# EAGLE design Circuit2 (EAGLE 7.7.0)
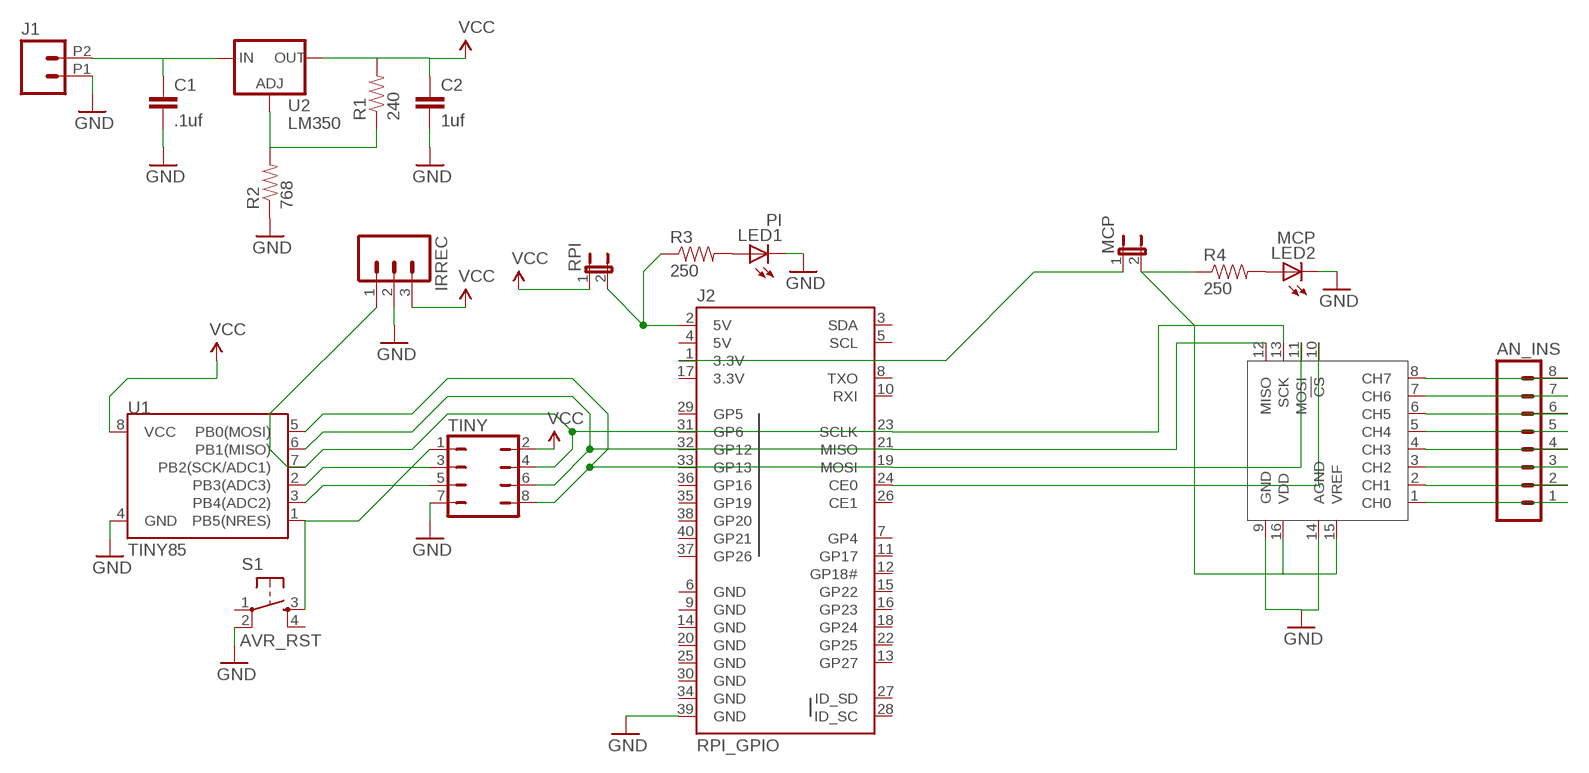
[diagram p0: schematic, sheet 1]

## Parts
ADC  MCP3008SL  [SO16]
AN_INS  M08  [1X08_ROUND]
C1  .1uf  CAP0805  [0805]
C2  1uf  CAP0805  [0805]
IRREC  M03PTH  [1X03]
J1  M022.54MM_SCREWTERM  [1X02_2.54_SCREWTERM]
J2  RPI_GPIO  RASPBERRYPI-40-PIN-GPIO  [2X20-SHROUDED]
LED1  PI  LED1206  [LED-1206]
LED2  MCP  LED1206  [LED-1206]
MCP  JP1E  [JP1]
R1  240  RESISTOR0805-RES  [0805]
R2  768  RESISTOR0805-RES  [0805]
R3  250  RESISTOR1206  [1206]
R4  250  RESISTOR1206  [1206]
RPI  JP1E  [JP1]
S1  AVR_RST  TACTILE-SWITCH-PTH  [TAC-SWITCH-PTH]
TINY  JP4Q  [JP4Q]
U1  TINY85  ATTINY45TINY85-20-DIP  [DIP08]
U2  LM350  V_REG_317SINK  [TO220-ADJ]

## Nets
GND [VCC]: ADC.9(GND) ADC.14(AGND) C1.2 C2.2 IRREC.2 J1.P1 J2.39(GND) LED1.C LED2.C R2.1 S1.2 TINY.7 U1.4(GND)
N$1: ADC.11(MOSI) J2.19(MOSI) TINY.8 U1.5(PB0(MOSI))
N$2: ADC.12(MISO) J2.21(MISO) TINY.6 U1.6(PB1(MISO))
N$3: ADC.13(SCK) IRREC.1 J2.23(SCLK) TINY.4 U1.7(PB2(SCK/ADC1))
N$4 [VCC]: J2.2(5V) R3.1 RPI.2
N$5: TINY.3 U1.2(PB3(ADC3))
N$6: S1.3 TINY.1 U1.1(PB5(NRES))
N$7: TINY.5 U1.3(PB4(ADC2))
N$8: ADC.15(VREF) ADC.16(VDD) MCP.2 R4.1
N$9: R1.1 R2.2 U2.ADJ
N$10: ADC.8(CH7) AN_INS.8
N$11: C1.1 J1.P2 U2.IN
N$12: ADC.10(!CS) J2.24(CE0)
N$13: J2.1(3.3V) MCP.1
N$14: ADC.7(CH6) AN_INS.7
N$15: ADC.6(CH5) AN_INS.6
N$16: ADC.5(CH4) AN_INS.5
N$17: ADC.4(CH3) AN_INS.4
N$18: ADC.3(CH2) AN_INS.3
N$19: ADC.2(CH1) AN_INS.2
N$20: ADC.1(CH0) AN_INS.1
N$21: LED1.A R3.2
N$22: LED2.A R4.2
VCC [VCC]: C2.1 IRREC.3 R1.2 RPI.1 TINY.2 U1.8(VCC) U2.OUT
Unconnected: J2.3(SDA) J2.5(SCL) J2.7(GP4) J2.8(TXO) J2.10(RXI) J2.11(GP17) J2.12(GP18#) J2.13(GP27) J2.15(GP22) J2.16(GP23) J2.18(GP24) J2.22(GP25) J2.26(CE1) J2.27(ID_SD) J2.28(ID_SC) J2.29(GP5) J2.31(GP6) J2.32(GP12) J2.33(GP13) J2.35(GP19) J2.36(GP16) J2.37(GP26) J2.38(GP20) J2.40(GP21) S1.1 S1.4

## Power pins joined to a net without a drawn wire
3.3V: J2.17(3.3V)
5V: J2.4(5V)
GND: J2.6(GND) J2.9(GND) J2.14(GND) J2.20(GND) J2.25(GND) J2.30(GND) J2.34(GND)

## Library data of the parts
ADC = MCP3008:MCP3008
AN_INS = SparkFun-Connectors:M08: Header 8 Standard 8-pin 0.1" header. Use with straight break away headers (SKU : PRT-00116), right angle break away headers (PRT-00553), swiss pins (PRT-00743), machine pins (PRT-00117), and female headers (PRT-00115).; PROD_ID: CONN-08437
C1 C2 = SparkFun-Capacitors:CAP: Capacitor Standard 0603 ceramic capacitor, and 0.1" leaded capacitor.
IRREC = SparkFun-Connectors:M03: Header 3 Standard 3-pin 0.1" header. Use with straight break away headers (SKU : PRT-00116), right angle break away headers (PRT-00553), swiss pins (PRT-00743), machine pins (PRT-00117), and female headers (PRT-00115). Molex polarized connector foot print use with SKU : PRT-08232 with associated crimp pins and housings.
J1 = SparkFun-Connectors:M02: Standard 2-pin 0.1" header. Use with - straight break away headers ( PRT-00116) - right angle break away headers (PRT-00553) - swiss pins (PRT-00743) - machine pins (PRT-00117) - female headers (PRT-00115) Molex polarized connector foot print use with: PRT-08233 with associated crimp pins and housings. 2.54_SCREWTERM for use with PRT-10571. 3.5mm Screw Terminal footprints for PRT-08084 5mm Screw Terminal footprints for use with PRT-08432
J2 = SparkFun-Boards:RASPBERRYPI-40-PIN-GPIO: Second Generation Raspberry Pi GPIO Header 2x20 pin connector, as found on B, B+, A+ models.
LED1 LED2 = LilyPad-Wearables:LED: LEDs Standard schematic elements and footprints for 5mm, 3mm, 1206, and 0603 sized LEDs. 5mm - Spark Fun Electronics SKU : Comp-SBL
MCP RPI = jumper:JP1E: JUMPER
R1-R4 = SparkFun-Passives:RESISTOR: Resistor Basic schematic elements and footprints for 0603, 1206, and PTH resistors.
S1 = GeekAmmo:TACTILE-SWITCH: Tactile Switch 4 Pins, SPST NO
TINY = jumper:JP4Q: JUMPER
U1 = SparkFun-DigitalIC:ATTINY45: Atmel 8-pin 2/4/8kB flash uC; PROD_ID: IC-09445; VALUE: TINY85-20-DIP
U2 = SparkFun-PowerIC:V_REG_317: Voltage Regulator Standard LM317 adjustable voltage regulator. AOI (Adjust Output Input). Google 'LM317 Calculator' for easy to use app to get the two resistor values needed. 240/720 for 5V output. 240/390 for 3.3V output. Spark Fun Electronics SKU : COM-00527

## Net classes
0 default: width 0.254 mm
1 VCC: width 0.635 mm

## Board
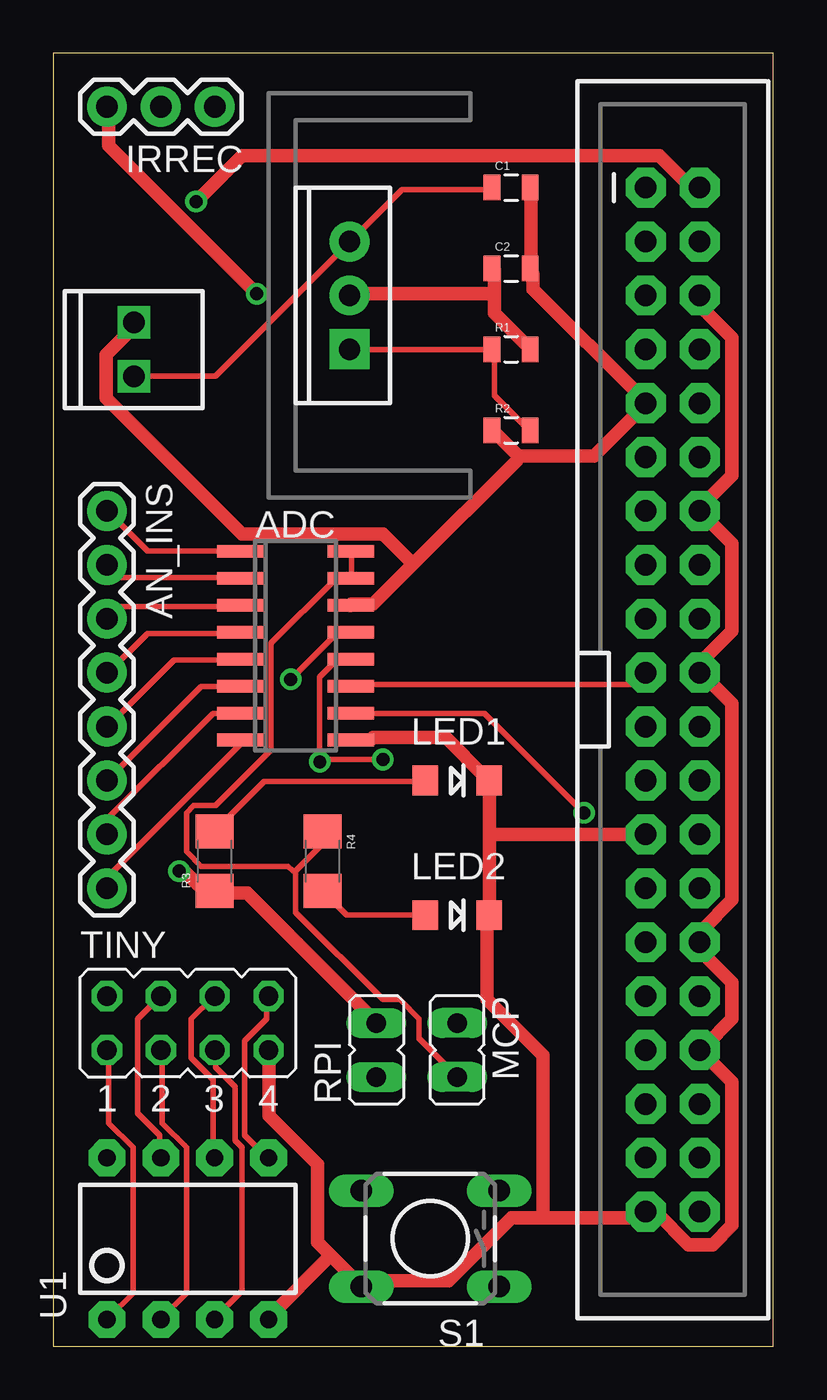
[diagram p1: board, top side]
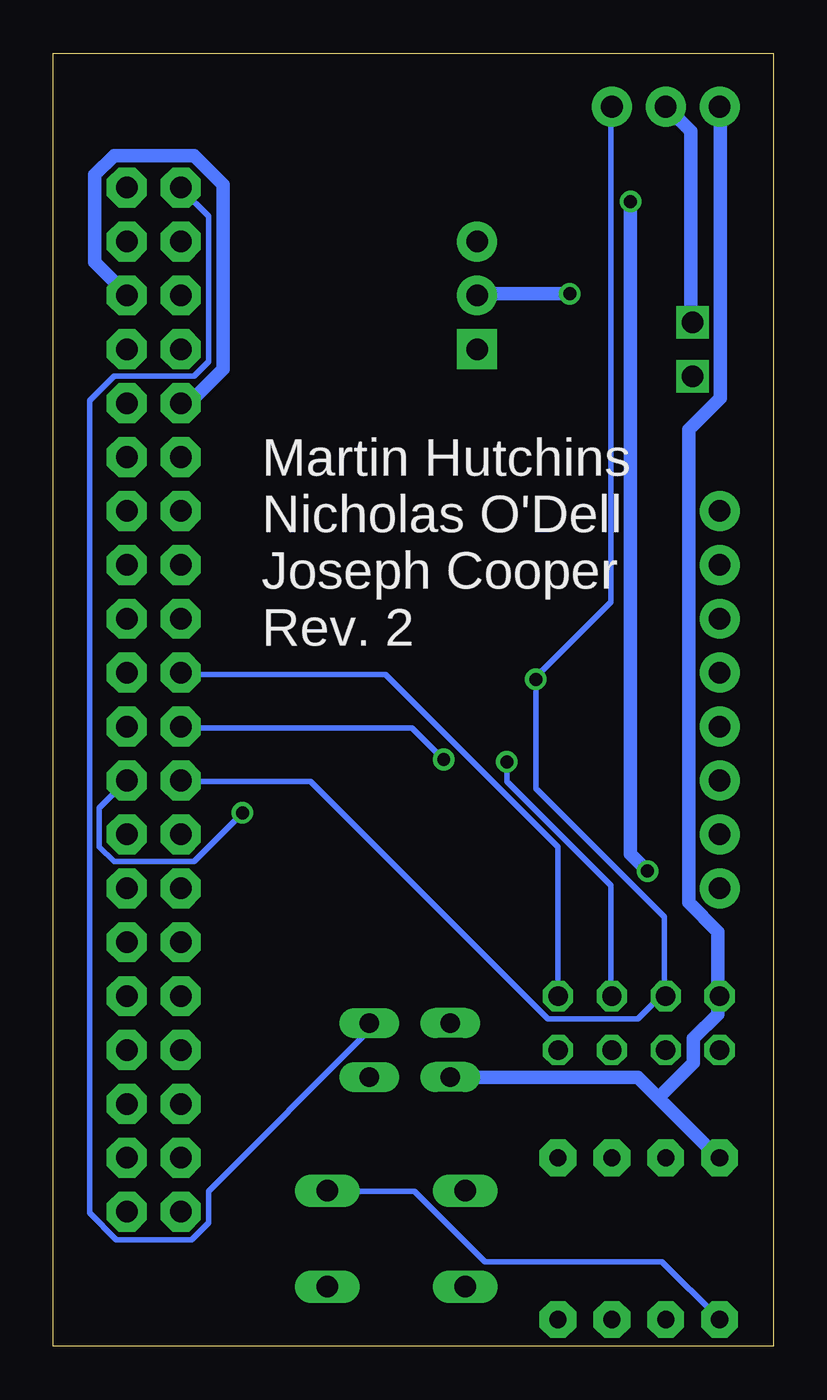
[diagram p2: board, bottom side, seen from below]

Size 33.96 x 60.95 mm. Coordinates in mm from the lower left corner, seen from the top.
Outline: 0,0 33.96,0 33.96,60.95 0,60.95 0,0
Copper layers (1*16): Top 0.035mm / dielectric 1.5mm / Bottom 0.035mm
Design rules "default": minimum track width 10mil, minimum drill 24mil, track to track 8mil, track to pad 8mil, pad to pad 8mil, via to via 8mil, smd to smd 8mil, copper to edge 40mil, drill to drill 8mil, minimum pad ring 10mil, minimum via ring 8mil, stop-mask expansion 4mil, vias tented up to drill 0mil, thermal gap 10mil

### Footprints (pad centres in the part's own frame; a part is rotated, then mirrored left to right if it is on the bottom)
SO16 = smd 0.6 x 2.2: 1 -4.445,-2.6; 2 -3.175,-2.6; 3 -1.905,-2.6; 4 -0.635,-2.6; 5 0.635,-2.6; 6 1.905,-2.6; 7 3.175,-2.6; 8 4.445,-2.6; 9 4.445,2.6; 10 3.175,2.6; 11 1.905,2.6; 12 0.635,2.6; 13 -0.635,2.6; 14 -1.905,2.6; 15 -3.175,2.6; 16 -4.445,2.6
1X08_ROUND = drill 1.016 pad 1.88: 1 0,0; 2 2.54,0; 3 5.08,0; 4 7.62,0; 5 10.16,0; 6 12.7,0; 7 15.24,0; 8 17.78,0
0805 = smd 0.8 x 1.2: 1 -0.9,0; 2 0.9,0
1X03 = drill 1.016 pad 1.88: 1 0,0; 2 2.54,0; 3 5.08,0
1X02_2.54_SCREWTERM = drill 1.016 square: P1 2.54,0; P2 0,0
2X20-SHROUDED = drill 1.016 pad 1.88 octagon: 1 -1.27,24.13; 2 1.27,24.13; 3 -1.27,21.59; 4 1.27,21.59; 5 -1.27,19.05; 6 1.27,19.05; 7 -1.27,16.51; 8 1.27,16.51; 9 -1.27,13.97; 10 1.27,13.97; 11 -1.27,11.43; 12 1.27,11.43; 13 -1.27,8.89; 14 1.27,8.89; 15 -1.27,6.35; 16 1.27,6.35; 17 -1.27,3.81; 18 1.27,3.81; 19 -1.27,1.27; 20 1.27,1.27; 21 -1.27,-1.27; 22 1.27,-1.27; 23 -1.27,-3.81; 24 1.27,-3.81; 25 -1.27,-6.35; 26 1.27,-6.35; 27 -1.27,-8.89; 28 1.27,-8.89; 29 -1.27,-11.43; 30 1.27,-11.43; 31 -1.27,-13.97; 32 1.27,-13.97; 33 -1.27,-16.51; 34 1.27,-16.51; 35 -1.27,-19.05; 36 1.27,-19.05; 37 -1.27,-21.59; 38 1.27,-21.59; 39 -1.27,-24.13; 40 1.27,-24.13
LED-1206 = smd 1.2 x 1.4: A -1.5,0; C 1.5,0
JP1 = drill 0.914 long: 1 0,-1.27; 2 0,1.27
1206 = smd 1.6 x 1.8: 1 -1.4,0; 2 1.4,0
TAC-SWITCH-PTH = drill 1.016 pad 1.524 long: 1 -3.251,2.261; 2 3.251,2.261; 3 -3.251,-2.261; 4 3.251,-2.261
JP4Q = drill 0.914 octagon: 1 -3.81,-1.27; 2 -3.81,1.27; 3 -1.27,-1.27; 4 -1.27,1.27; 5 1.27,-1.27; 6 1.27,1.27; 7 3.81,-1.27; 8 3.81,1.27
DIP08 = drill 0.813 pad 1.727 octagon: 1 -3.81,-3.81; 2 -1.27,-3.81; 3 1.27,-3.81; 4 3.81,-3.81; 5 3.81,3.81; 6 1.27,3.81; 7 -1.27,3.81; 8 -3.81,3.81
TO220-ADJ = drill 1 pad 1.88 square: ADJ -2.54,0 | drill 1 pad 1.88: IN 2.54,0; OUT 0,0

### Placement (x,y rotation side)
ADC  11.43,33.02 270 top
AN_INS  2.54,39.37 270 top
C1  21.59,54.61 0 top
C2  21.59,50.8 0 top
IRREC  7.62,58.42 180 top
J1  3.81,45.72 90 top
J2  29.21,30.48 0 top
LED1  19.05,26.67 0 top
LED2  19.05,20.32 0 top
MCP  19.05,13.97 180 top
R1  21.59,46.99 0 top
R2  21.59,43.18 0 top
R3  7.62,22.86 90 top
R4  12.7,22.86 270 top
RPI  15.24,13.97 0 top
S1  17.78,5.08 180 top
TINY  6.35,15.24 0 top
U1  6.35,5.08 0 top
U2  13.97,49.53 90 top

### Tracks (layer width: path | path; a pad name or v marks a point on that pad's centre or on a via)
GND
  Top 0.635: C1.2 22.52,54.52 22.52,50.86 C2.2 22.63,50.52 22.63,49.84 27.77,44.69 J2.9 27.89,44.35 25.49,41.95 21.95,41.95 | 21.95,41.95 20.8,43.09 R2.1 | 16.97,36.86 21.83,41.72 21.95,41.95 | 16.97,36.86 15.09,34.98 14.06,34.98 ADC.14 | 16.97,36.86 15.54,38.29 8.91,38.29 2.52,44.69 2.52,46.75 3.77,48.01 3.77,48.23 J1.P1 | 20.57,24.12 20.57,26.63 LED1.C 20.34,26.86 18.52,28.69 15.09,28.69 14.97,28.57 ADC.9 | 20.57,24.12 20.57,20.34 LED2.C 20.46,20 20.46,16.34 23.09,13.72 23.09,6.06 | 20.57,24.12 27.89,24.12 J2.25 | 13.09,4.29 14.52,2.86 S1.2 14.74,3.09 18.63,3.09 21.6,6.06 23.09,6.06 | 13.09,4.29 12.46,4.92 12.46,8.57 10.17,10.86 10.17,13.95 TINY.7 | 13.09,4.29 10.17,1.37 U1.4 | J2.6 30.52,49.49 30.52,49.03 32,47.55 32,41.03 30.63,39.66 J2.14 30.52,39.32 32,37.83 32,33.72 30.52,32.23 30.52,31.77 J2.20 30.75,31.55 32,30.29 32,21.03 30.63,19.66 30.63,19.32 J2.30 30.52,18.97 30.52,18.63 32,17.14 32,15.43 30.75,14.17 J2.34 30.52,13.95 32,12.46 32,5.71 31.09,4.8 29.95,4.8 28.46,6.29 28,6.29 J2.39 27.66,6.29 27.43,6.06 23.09,6.06
  Bottom 0.635: J1.P1 3.89,48.35 3.89,57.26 5.03,58.41 IRREC.2 | J2.9 27.89,44.46 27.55,44.46 25.95,46.06 25.95,54.75 27.32,56.12 31.09,56.12 32,55.21 32,51.09 30.52,49.61 J2.6
N$1
  Top 0.254: TINY.8 10.06,16.46 10.06,15.43 9.03,14.4 9.03,9.94 10.06,8.91 U1.5 | ADC.11 14.06,31.2 27.43,31.2 27.89,31.66 J2.19
  Bottom 0.254: TINY.8 10.17,16.57 10.17,23.55 18.29,31.66 27.89,31.66 J2.19
N$2  (via drill 0.61)
  Top 0.254: ADC.12 13.95,32.35 13.37,32.35 12.57,31.55 v12.57,27.55 12.69,27.66 v15.54,27.66 | U1.6 7.54,8.91 7.54,12.57 6.51,13.6 6.51,15.43 7.54,16.46 TINY.6
  Bottom 0.254: v12.57,27.55 12.57,26.63 7.66,21.72 7.66,16.57 TINY.6 | v15.54,27.66 17.03,29.15 27.89,29.15 J2.21
N$3  (via drill 0.61)
  Top 0.254: v11.2,31.43 13.37,33.6 13.95,33.6 ADC.13 | TINY.4 4,15.43 4,10.97 5.03,9.94 5.03,8.91 U1.7
  Bottom 0.254: J2.23 27.89,26.63 21.83,26.63 10.63,15.43 6.4,15.43 5.26,16.57 TINY.4 5.14,16.57 5.14,20.23 11.2,26.29 v11.2,31.43 11.2,31.55 7.66,35.09 7.66,58.41 IRREC.1
N$4  (via drill 0.61)
  Top 0.635: RPI.2 15.2,15.32 9.14,21.37 7.66,21.37 R3.1 7.32,21.49 7.09,21.49 6.17,22.4 v5.94,22.4 | v6.74,53.95 8.91,56.12 28.57,56.12 30.06,54.63 30.4,54.63 J2.2
  Bottom 0.635: v6.74,53.95 6.74,23.2 v5.94,22.4
N$5
  Top 0.254: TINY.3 5.14,13.95 5.14,10.52 6.29,9.37 6.29,2.52 5.14,1.37 U1.2
N$6
  Top 0.254: TINY.1 2.63,13.95 2.63,10.52 3.77,9.37 3.77,2.52 2.63,1.37 U1.1
  Bottom 0.254: S1.3 21.03,7.32 16.92,7.32 13.6,4 5.26,4 2.63,1.37 U1.1
N$7
  Top 0.254: TINY.5 7.66,13.95 7.66,13.14 8.57,12.23 8.57,9.72 8.91,9.37 8.91,2.63 7.66,1.37 U1.3
N$8
  Top 0.254: ADC.16 14.06,37.38 14.06,36.23 ADC.15 13.95,36.12 13.26,36.12 10.29,33.15 10.29,28.12 7.66,25.49 6.63,25.49 6.29,25.15 6.29,23.32 6.97,22.63 11.09,22.63 11.32,22.4 11.43,22.4 | 11.43,22.4 12.69,23.66 12.69,24.23 R4.1 | 11.43,22.4 11.43,20.46 15.54,16.34 16.34,16.34 17.26,15.43 17.26,14.52 18.97,12.8 MCP.2
N$9
  Top 0.254: R2.2 22.4,43.2 20.8,44.81 20.8,46.98 R1.1 20.57,46.98 14.06,46.98 U2.ADJ
N$10
  Top 0.254: ADC.8 8.8,28.57 8.8,28.35 2.63,22.17 2.63,21.6 AN_INS.8
N$11
  Top 0.254: C1.1 20.69,54.52 16.46,54.52 14.06,52.12 U2.IN 13.95,52.01 7.66,45.72 J1.P2
N$12  (via drill 0.61)
  Top 0.254: v25.03,25.15 20.34,29.83 14.06,29.83 ADC.10
  Bottom 0.254: v25.03,25.15 27.32,22.86 31.09,22.86 31.77,23.55 31.77,25.38 J2.24
N$13
  Bottom 0.254: MCP.1 19.09,15.2 19.09,14.86 26.63,7.32 26.63,5.83 27.43,5.03 30.98,5.03 32.23,6.29 32.23,44.58 31.09,45.72 27.32,45.72 26.63,46.41 26.63,53.26 27.89,54.52 J2.1
N$14
  Top 0.254: ADC.7 8.8,29.83 7.54,29.83 2.63,24.92 2.63,24.23 AN_INS.7
N$15
  Top 0.254: ADC.6 8.8,31.09 6.97,31.09 2.63,26.75 AN_INS.6
N$16
  Top 0.254: ADC.5 8.8,32.35 5.71,32.35 2.63,29.26 AN_INS.5
N$17
  Top 0.254: ADC.4 8.8,33.6 4.46,33.6 2.63,31.77 AN_INS.4
N$18
  Top 0.254: ADC.3 8.8,34.86 3.2,34.86 2.63,34.29 AN_INS.3
N$19
  Top 0.254: ADC.2 8.8,36.23 3.2,36.23 2.63,36.8 AN_INS.2
N$20
  Top 0.254: ADC.1 8.8,37.49 4.46,37.49 2.63,39.32 AN_INS.1
N$21
  Top 0.254: LED1.A 17.49,26.63 9.94,26.63 7.66,24.35 R3.2
N$22
  Top 0.254: LED2.A 17.49,20.34 13.83,20.34 12.8,21.37 R4.2
VCC  (via drill 0.61)
  Top 0.635: 20.8,49.61 20.8,48.69 22.4,47.09 R1.2 | 20.8,49.61 20.8,50.75 C2.1 | 20.8,49.61 14.06,49.61 U2.OUT | v9.6,49.61 2.63,56.58 2.63,58.41 IRREC.3
  Bottom 0.635: 5.43,11.72 2.63,8.91 U1.8 | 5.43,11.72 6.4,12.69 15.2,12.69 RPI.1 | 5.43,11.72 3.77,13.37 3.77,14.52 2.63,15.66 2.63,16.46 TINY.2 2.63,16.8 2.63,19.55 4,20.92 4,43.2 2.52,44.69 2.52,58.41 IRREC.3 | v9.6,49.61 13.95,49.61 U2.OUT

### Text on the board
bNames: Martin Hutchins / Nicholas O'Dell / Joseph Cooper / Rev. 2